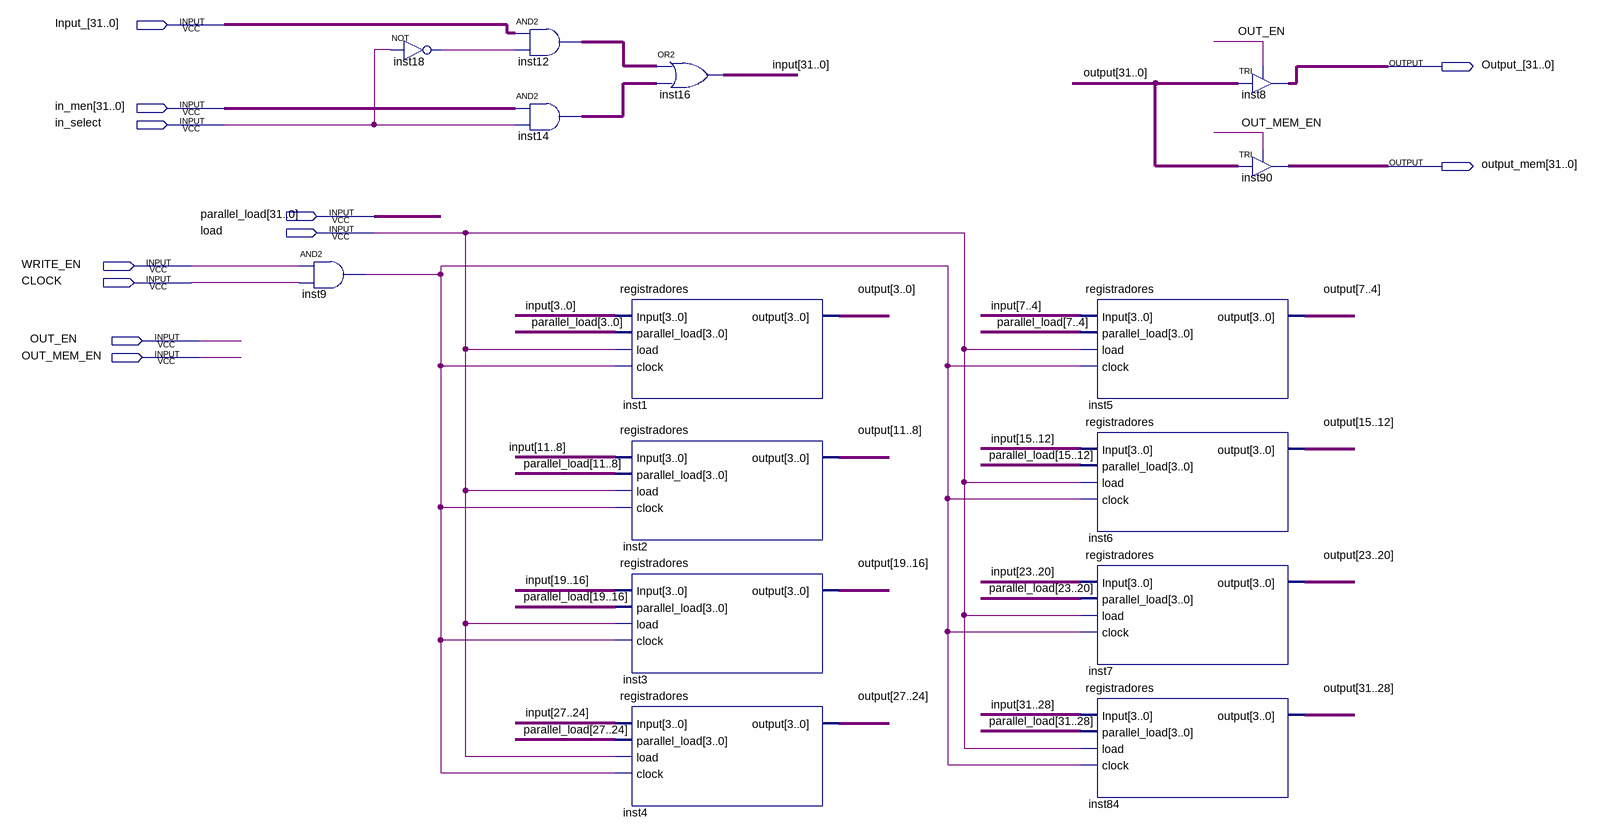
[diagram p0: schematic sheet]
// Quartus schematic registradores_32bits.bdf as structural Verilog: 15 symbols, 11 pins
module registradores_32bits (
  input  [31:0] Input_,
  input  [31:0] in_men,
  input  in_select,
  input  [31:0] parallel_load,
  input  load,
  input  WRITE_EN,
  input  CLOCK,
  input  OUT_EN,
  input  OUT_MEM_EN,
  output [31:0] Output_,
  output [31:0] output_mem
);

  wire inst9_out, inst18_out;
  wire [31:0] \input , inst12_out, inst14_out, \output ;

  and inst9 (inst9_out, WRITE_EN, CLOCK);
  not inst18 (inst18_out, in_select);
  assign inst12_out = Input_ & {32{inst18_out}};  // AND2 inst12, 32 bits wide
  assign inst14_out = in_men & {32{in_select}};  // AND2 inst14, 32 bits wide
  registradores inst1 (
    .Input(\input [3:0]), .parallel_load(parallel_load[3:0]), .load(load), .clock(inst9_out),
    .\output (\output [3:0]));
  registradores inst2 (
    .Input(\input [11:8]), .parallel_load(parallel_load[11:8]), .load(load), .clock(inst9_out),
    .\output (\output [11:8]));
  registradores inst3 (
    .Input(\input [19:16]), .parallel_load(parallel_load[19:16]), .load(load), .clock(inst9_out),
    .\output (\output [19:16]));
  registradores inst4 (
    .Input(\input [27:24]), .parallel_load(parallel_load[27:24]), .load(load), .clock(inst9_out),
    .\output (\output [27:24]));
  assign \input  = inst12_out | inst14_out;  // OR2 inst16, 32 bits wide
  registradores inst5 (
    .Input(\input [7:4]), .parallel_load(parallel_load[7:4]), .load(load), .clock(inst9_out),
    .\output (\output [7:4]));
  registradores inst6 (
    .Input(\input [15:12]), .parallel_load(parallel_load[15:12]), .load(load), .clock(inst9_out),
    .\output (\output [15:12]));
  registradores inst7 (
    .Input(\input [23:20]), .parallel_load(parallel_load[23:20]), .load(load), .clock(inst9_out),
    .\output (\output [23:20]));
  registradores inst84 (
    .Input(\input [31:28]), .parallel_load(parallel_load[31:28]), .load(load), .clock(inst9_out),
    .\output (\output [31:28]));
  TRI inst8[31:0] (.IN(\output ), .OE(OUT_EN), .OUT(Output_));
  TRI inst90[31:0] (.IN(\output ), .OE(OUT_MEM_EN), .OUT(output_mem));
endmodule
